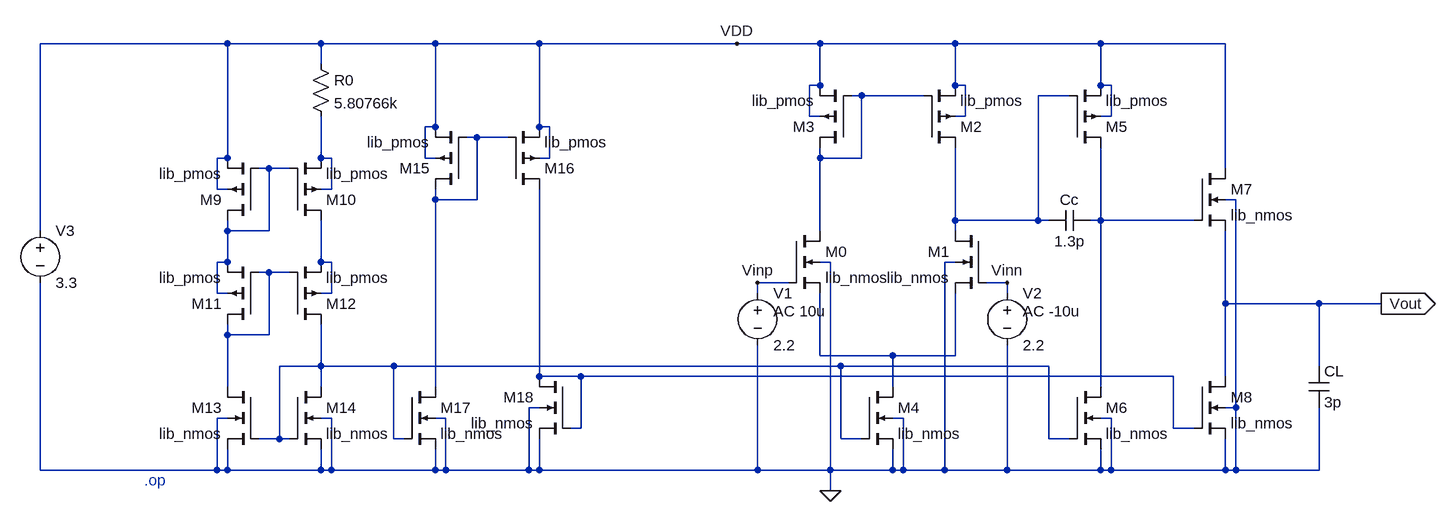
[diagram p0: schematic opamp.asc]
opamp.asc, the LTspice schematic file:
Version 4
SHEET 1 1392 5408
WIRE -784 -592 -1072 -592
WIRE -640 -592 -784 -592
WIRE -464 -592 -640 -592
WIRE -304 -592 -464 -592
WIRE 0 -592 -304 -592
WIRE 128 -592 0 -592
WIRE 336 -592 128 -592
WIRE 560 -592 336 -592
WIRE 752 -592 560 -592
WIRE -640 -560 -640 -592
WIRE 128 -528 128 -592
WIRE 128 -528 112 -528
WIRE 336 -528 336 -592
WIRE 352 -528 336 -528
WIRE 560 -528 560 -592
WIRE 576 -528 560 -528
WIRE 192 -512 176 -512
WIRE 288 -512 192 -512
WIRE 512 -512 464 -512
WIRE 112 -480 112 -528
WIRE 128 -480 112 -480
WIRE 352 -480 352 -528
WIRE 352 -480 336 -480
WIRE 576 -480 576 -528
WIRE 576 -480 560 -480
WIRE -464 -464 -464 -592
WIRE -464 -464 -480 -464
WIRE -304 -464 -304 -592
WIRE -288 -464 -304 -464
WIRE -400 -448 -416 -448
WIRE -352 -448 -400 -448
WIRE -784 -416 -784 -592
WIRE -784 -416 -800 -416
WIRE -640 -416 -640 -480
WIRE -624 -416 -640 -416
WIRE -480 -416 -480 -464
WIRE -464 -416 -480 -416
WIRE -288 -416 -288 -464
WIRE -288 -416 -304 -416
WIRE 128 -416 128 -432
WIRE 192 -416 192 -512
WIRE 192 -416 128 -416
WIRE -720 -400 -736 -400
WIRE -688 -400 -720 -400
WIRE 752 -400 752 -592
WIRE -800 -368 -800 -416
WIRE -784 -368 -800 -368
WIRE -624 -368 -624 -416
WIRE -624 -368 -640 -368
WIRE -464 -352 -464 -368
WIRE -400 -352 -400 -448
WIRE -400 -352 -464 -352
WIRE 768 -352 752 -352
WIRE 336 -320 336 -432
WIRE 464 -320 464 -512
WIRE 464 -320 336 -320
WIRE 480 -320 464 -320
WIRE 560 -320 560 -432
WIRE 560 -320 544 -320
WIRE 704 -320 560 -320
WIRE -1072 -304 -1072 -592
WIRE -784 -304 -784 -320
WIRE -720 -304 -720 -400
WIRE -720 -304 -784 -304
WIRE 128 -304 128 -416
WIRE 336 -304 336 -320
WIRE -784 -256 -784 -304
WIRE -784 -256 -800 -256
WIRE -640 -256 -640 -320
WIRE -624 -256 -640 -256
WIRE 144 -256 128 -256
WIRE 336 -256 320 -256
WIRE -720 -240 -736 -240
WIRE -688 -240 -720 -240
WIRE 80 -224 32 -224
WIRE 416 -224 384 -224
WIRE -800 -208 -800 -256
WIRE -784 -208 -800 -208
WIRE -624 -208 -624 -256
WIRE -624 -208 -640 -208
WIRE 32 -208 32 -224
WIRE 416 -208 416 -224
WIRE 752 -192 752 -304
WIRE 896 -192 752 -192
WIRE 992 -192 896 -192
WIRE -784 -144 -784 -160
WIRE -720 -144 -720 -240
WIRE -720 -144 -784 -144
WIRE 128 -112 128 -208
WIRE 240 -112 128 -112
WIRE 336 -112 336 -208
WIRE 336 -112 240 -112
WIRE -640 -96 -640 -160
WIRE -640 -96 -704 -96
WIRE -528 -96 -640 -96
WIRE 160 -96 -528 -96
WIRE 480 -96 160 -96
WIRE 896 -96 896 -192
WIRE -304 -80 -304 -368
WIRE -240 -80 -304 -80
WIRE 672 -80 -240 -80
WIRE 752 -80 752 -192
WIRE -784 -64 -784 -144
WIRE -640 -64 -640 -96
WIRE -464 -64 -464 -352
WIRE 240 -64 240 -112
WIRE 560 -64 560 -320
WIRE -304 -32 -320 -32
WIRE 768 -32 768 -352
WIRE 768 -32 752 -32
WIRE -784 -16 -800 -16
WIRE -624 -16 -640 -16
WIRE -448 -16 -464 -16
WIRE 256 -16 240 -16
WIRE 576 -16 560 -16
WIRE -240 0 -240 -80
WIRE -240 0 -256 0
WIRE 672 0 672 -80
WIRE 704 0 672 0
WIRE -704 16 -704 -96
WIRE -704 16 -736 16
WIRE -688 16 -704 16
WIRE -528 16 -528 -96
WIRE -512 16 -528 16
WIRE 160 16 160 -96
WIRE 192 16 160 16
WIRE 480 16 480 -96
WIRE 512 16 480 16
WIRE -1072 64 -1072 -224
WIRE -800 64 -800 -16
WIRE -800 64 -1072 64
WIRE -784 64 -784 32
WIRE -784 64 -800 64
WIRE -640 64 -640 32
WIRE -640 64 -784 64
WIRE -624 64 -624 -16
WIRE -624 64 -640 64
WIRE -464 64 -464 32
WIRE -464 64 -624 64
WIRE -448 64 -448 -16
WIRE -448 64 -464 64
WIRE -320 64 -320 -32
WIRE -320 64 -448 64
WIRE -304 64 -304 16
WIRE -304 64 -320 64
WIRE 32 64 32 -128
WIRE 32 64 -304 64
WIRE 144 64 144 -256
WIRE 144 64 32 64
WIRE 240 64 240 32
WIRE 240 64 144 64
WIRE 256 64 256 -16
WIRE 256 64 240 64
WIRE 320 64 320 -256
WIRE 320 64 256 64
WIRE 416 64 416 -128
WIRE 416 64 320 64
WIRE 560 64 560 32
WIRE 560 64 416 64
WIRE 576 64 576 -16
WIRE 576 64 560 64
WIRE 752 64 752 16
WIRE 752 64 576 64
WIRE 768 64 768 -32
WIRE 768 64 752 64
WIRE 896 64 896 -32
WIRE 896 64 768 64
WIRE 144 96 144 64
FLAG 144 96 0
FLAG 0 -592 VDD
FLAG 32 -224 Vinp
FLAG 416 -224 Vinn
FLAG 992 -192 Vout
IOPIN 992 -192 Out
SYMBOL nmos4 -688 -64 R0
SYMATTR InstName M14
SYMATTR Value2 l=l_m14 w=w_m14
SYMATTR Value lib_nmos
SYMBOL nmos4 -736 -64 M0
SYMATTR InstName M13
SYMATTR Value2 l=l_m13 w=w_m13
SYMATTR Value lib_nmos
SYMBOL pmos4 -688 -160 M180
SYMATTR InstName M12
SYMATTR Value2 l=l_m12 w=w_m12
SYMATTR Value lib_pmos
SYMBOL pmos4 -688 -320 M180
SYMATTR InstName M10
SYMATTR Value2 l=l_m10 w=w_m10
SYMATTR Value lib_pmos
SYMBOL pmos4 -736 -160 R180
SYMATTR InstName M11
SYMATTR Value2 l=l_m11 w=w_m11
SYMATTR Value lib_pmos
SYMBOL pmos4 -736 -320 R180
SYMATTR InstName M9
SYMATTR Value2 l=l_m9 w=w_m9
SYMATTR Value lib_pmos
SYMBOL res -656 -576 R0
SYMATTR InstName R0
SYMATTR Value 5.80766k
SYMBOL nmos4 192 -64 R0
SYMATTR InstName M4
SYMATTR Value2 l=l_m4 w=w_m4
SYMATTR Value lib_nmos
SYMBOL nmos4 80 -304 R0
SYMATTR InstName M0
SYMATTR Value2 l=l_m0 w=w_m0
SYMATTR Value lib_nmos
SYMBOL nmos4 384 -304 M0
SYMATTR InstName M1
SYMATTR Value2 l=l_m1 w=w_m1
SYMATTR Value lib_nmos
SYMBOL pmos4 288 -432 M180
SYMATTR InstName M2
SYMATTR Value2 l=l_m2 w=w_m2
SYMATTR Value lib_pmos
SYMBOL pmos4 176 -432 R180
SYMATTR InstName M3
SYMATTR Value2 l=l_m3 w=w_m3
SYMATTR Value lib_pmos
SYMBOL nmos4 512 -64 R0
SYMATTR InstName M6
SYMATTR Value2 l=l_m6 w=w_m6
SYMATTR Value lib_nmos
SYMBOL pmos4 512 -432 M180
SYMATTR InstName M5
SYMATTR Value2 l=l_m5 w=w_m5
SYMATTR Value lib_pmos
SYMBOL voltage 32 -224 R0
WINDOW 123 24 44 Left 2
WINDOW 39 0 0 Left 0
SYMATTR Value2 AC 10u
SYMATTR InstName V1
SYMATTR Value 2.2
SYMBOL voltage 416 -224 R0
WINDOW 123 24 44 Left 2
WINDOW 39 0 0 Left 0
SYMATTR Value2 AC -10u
SYMATTR InstName V2
SYMATTR Value 2.2
SYMBOL voltage -1072 -320 R0
WINDOW 123 0 0 Left 0
WINDOW 39 0 0 Left 0
SYMATTR InstName V3
SYMATTR Value 3.3
SYMBOL cap 880 -96 R0
SYMATTR InstName CL
SYMATTR Value 3p
SYMBOL nmos4 704 -400 R0
SYMATTR InstName M7
SYMATTR Value2 l=l_m7 w=w_m7
SYMATTR Value lib_nmos
SYMBOL nmos4 704 -80 R0
SYMATTR InstName M8
SYMATTR Value2 l=l_m8 w=w_m8
SYMATTR Value lib_nmos
SYMBOL nmos4 -512 -64 R0
SYMATTR InstName M17
SYMATTR Value2 l=l_m17 w=w_m17
SYMATTR Value lib_nmos
SYMBOL nmos4 -256 -80 M0
SYMATTR InstName M18
SYMATTR Value2 l=l_m18 w=w_m18
SYMATTR Value lib_nmos
SYMBOL pmos4 -416 -368 R180
SYMATTR InstName M15
SYMATTR Value2 l=l_m15 w=w_m15
SYMATTR Value lib_pmos
SYMBOL pmos4 -352 -368 M180
SYMATTR InstName M16
SYMATTR Value2 l=l_m16 w=w_m16
SYMATTR Value lib_pmos
SYMBOL cap 544 -336 R90
WINDOW 0 0 32 VBottom 2
WINDOW 3 32 32 VTop 2
SYMATTR InstName Cc
SYMATTR Value 1.3p
TEXT -912 80 Left 2 ;.op

The netlist it stands for:
* opamp.asc
M14 N010 N010 0 0 lib_nmos l=l_m14 w=w_m14
M13 N008 N010 0 0 lib_nmos l=l_m13 w=w_m13
M12 N010 N008 N007 N007 lib_pmos l=l_m12 w=w_m12
M10 N007 N005 N004 N004 lib_pmos l=l_m10 w=w_m10
M11 N008 N008 N005 N005 lib_pmos l=l_m11 w=w_m11
M9 N005 N005 VDD VDD lib_pmos l=l_m9 w=w_m9
R0 VDD N004 5.80766k
M4 N009 N010 0 0 lib_nmos l=l_m4 w=w_m4
M0 N001 Vinp N009 0 lib_nmos l=l_m0 w=w_m0
M1 N002 Vinn N009 0 lib_nmos l=l_m1 w=w_m1
M2 N002 N001 VDD VDD lib_pmos l=l_m2 w=w_m2
M3 N001 N001 VDD VDD lib_pmos l=l_m3 w=w_m3
M6 N006 N010 0 0 lib_nmos l=l_m6 w=w_m6
M5 N006 N002 VDD VDD lib_pmos l=l_m5 w=w_m5
V1 Vinp 0 2.2 AC 10u
V2 Vinn 0 2.2 AC -10u
V3 VDD 0 3.3
CL Vout 0 3p
M7 VDD N006 Vout 0 lib_nmos l=l_m7 w=w_m7
M8 Vout N011 0 0 lib_nmos l=l_m8 w=w_m8
M17 N003 N010 0 0 lib_nmos l=l_m17 w=w_m17
M18 N011 N011 0 0 lib_nmos l=l_m18 w=w_m18
M15 N003 N003 VDD VDD lib_pmos l=l_m15 w=w_m15
M16 N011 N003 VDD VDD lib_pmos l=l_m16 w=w_m16
Cc N006 N002 1.3p
.model NMOS NMOS
.model PMOS PMOS
.lib standard.mos
* .op
.backanno
.end